# EAGLE schematic page1 (EAGLE 6.3)
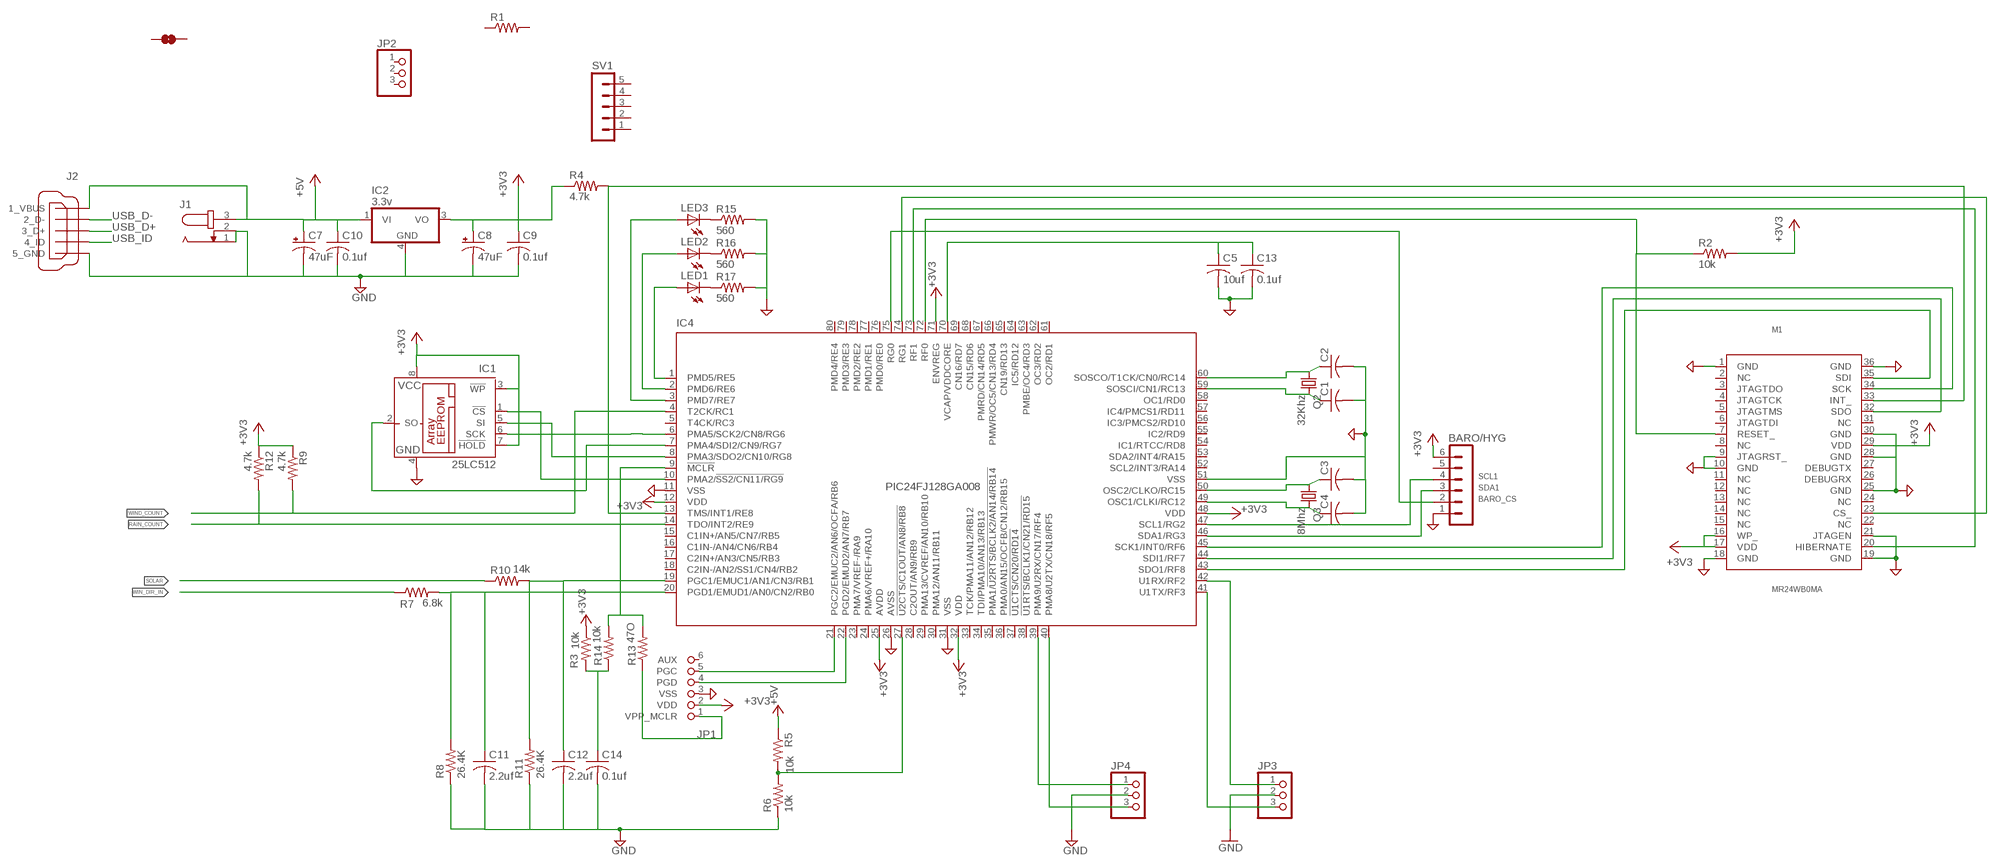
[diagram p0: schematic, sheet 1]

## Parts
BARO/HYG  MA06-1  [MA06-1]
C1  C-USC0603  [C0603]
C2  C-USC0603  [C0603]
C3  C-USC0603  [C0603]
C4  C-USC0603  [C0603]
C5  10uf  C-USC0805  [C0805]
C7  47uF  CPOL-US140CLH-0810  [140CLH-0810]
C8  47uF  CPOL-US140CLH-0810  [140CLH-0810]
C9  0.1uf  C-USC0805  [C0805]
C10  0.1uf  C-USC0805  [C0805]
C11  2.2uf  C-USC1206  [C1206]
C12  2.2uf  C-USC1206  [C1206]
C13  0.1uf  C-USC0805  [C0805]
C14  0.1uf  C-USC0805  [C0805]
IC1  25LC512  25LC080SN  [SO-08]
IC2  3.3v  78MXXL  [DPACK]
IC4  PIC24FJ128GA008  [TQFP80-12X12]
J1  JACK-PLUG0  [SPC4077]
J2  MINI-USB-32005-201  [32005-201]
JP1  PIKIT2_PRG  [1X06]
JP2  PINHD-1X3  [1X03]
JP3  PINHD-1X3  [1X03]
JP4  PINHD-1X3  [1X03]
LED1  LEDCHIP-LED0603  [CHIP-LED0603]
LED2  LEDCHIP-LED0603  [CHIP-LED0603]
LED3  LEDCHIP-LED0603  [CHIP-LED0603]
M1  MR24WB0MA  [MRF24W]
Q2  32Khz  CRYSTALTC26H  [TC26H]
Q3  8Mhz  CRYSTALHC49S  [HC49/S]
R1  R-US_R0603  [R0603]
R2  10k  R-US_R0603  [R0603]
R3  10k  R-US_R0603  [R0603]
R4  4.7k  R-US_R0603  [R0603]
R5  10k  R-US_R0603  [R0603]
R6  10k  R-US_R0603  [R0603]
R7  6.8k  R-US_R0603  [R0603]
R8  26.4K  R-US_R0603  [R0603]
R9  4.7k  R-US_R0603  [R0603]
R10  14k  R-US_R0603  [R0603]
R11  26.4K  R-US_R0603  [R0603]
R12  4.7k  R-US_R0603  [R0603]
R13  47O  R-US_R0603  [R0603]
R14  10k  R-US_R0603  [R0603]
R15  560  R-US_R0603  [R0603]
R16  560  R-US_R0603  [R0603]
R17  560  R-US_R0603  [R0603]
SV1  MA05-1  [MA05-1]
U$2  SOLDERBRIDGE  [SOLDER_BRIDGE]

## Nets
+3V3: BARO/HYG.6 C8.+ C9.1 IC1.3(!WP) IC1.7(!HOLD) IC1.8(VCC) IC2.3(VO) IC4.12(VDD) IC4.25(AVDD) IC4.32(VDD) IC4.48(VDD) IC4.71(ENVREG) JP1.2(VDD) M1.16(WP_) M1.17(VDD) M1.29(VDD) R2.2 R3.1 R4.1 R9.1 R12.1
+5V: C7.+ C10.1 IC2.1(VI) J1.3 J2.1_VBUS R5.1
BARO_CS: BARO/HYG.2 IC4.75(RG0)
GND: BARO/HYG.1 C1.2 C2.2 C3.2 C4.2 C5.2 C7.- C8.- C9.2 C10.2 C11.2 C12.2 C13.2 C14.2 IC1.4(GND) IC2.4(GND) IC4.11(VSS) IC4.26(AVSS) IC4.31(VSS) IC4.51(VSS) J1.1 J1.2 J2.5_USB_GND(5_GND) JP1.3(VSS) JP3.2 JP4.2 M1.1(GND) M1.9(JTAGRST_) M1.10(GND) M1.18(GND) M1.19(GND) M1.21(JTAGEN) M1.25(GND) M1.28(GND) M1.30(GND) M1.36(GND) R6.1 R8.1 R11.1 R15.2 R16.2 R17.2
N$1: C2.1 IC4.60(SOSCO/T1CK/CN0/RC14) Q2.1
N$2: C1.1 IC4.59(SOSCI/CN1/RC13) Q2.2
N$3: IC4.42(U1RX/RF2) JP3.1
N$4: C3.1 IC4.50(OSC2/CLKO/RC15) Q3.1
N$5: C4.1 IC4.49(OSC1/CLKI/RC12) Q3.2
N$6: IC4.41(U1TX/RF3) JP3.3
N$7: IC4.40(PMA8/U2TX/CN18/RF5) JP4.3
N$8: IC4.39(PMA9/U2RX/CN17/RF4) JP4.1
N$9: IC4.73(RF1) M1.20(HIBERNATE)
N$10: IC4.72(RF0) M1.7(RESET_) R2.1
N$11: IC4.45(SCK1/INT0/RF6) M1.34(SCK)
N$12: IC4.44(SDI1/RF7) M1.32(SDO)
N$13: IC4.43(SDO1/RF8) M1.35(SDI)
N$14: IC4.27(!U2CTS/C1OUT/AN8/RB8) R5.2 R6.2
N$15: IC4.74(RG1) M1.23(CS_)
N$16: IC4.21(PGC2/EMUC2/AN6/OCFA/RB6) JP1.5(PGC)
N$17: IC4.22(PGD2/EMUD2/AN7/RB7) JP1.4(PGD)
N$18: C12.1 IC4.19(PGC1/EMUC1/AN1/CN3/RB1) R10.2 R11.2
N$19: C5.1 C13.1 IC4.70(VCAP/VDDCORE)
N$20: IC4.9(!MCLR) R13.2 R14.2
N$21: C11.1 IC4.20(PGD1/EMUD1/AN0/CN2/RB0) R7.2 R8.2
N$22: C14.1 R3.2 R14.1
N$23: LED1.C R17.1
N$24: JP1.1(VPP_MCLR) R13.1
N$25: IC1.2(SO) IC4.7(PMA4/SDI2/CN9/RG7)
N$26: IC4.13(TMS/INT1/RE8) M1.33(INT_) R4.2
N$27: IC1.1(!CS) IC4.10(PMA2/!SS2/CN11/RG9)
N$28: LED2.C R16.1
N$29: IC1.6(SCK) IC4.6(PMA5/SCK2/CN8/RG6)
N$30: LED3.C R15.1
N$31: IC4.1(PMD5/RE5) LED1.A
N$32: IC1.5(SI) IC4.8(PMA3/SDO2/CN10/RG8)
N$33: IC4.2(PMD6/RE6) LED2.A
N$34: IC4.3(PMD7/RE7) LED3.A
RAIN_COUNT: IC4.14(TDO/INT2/RE9) R12.2
SCL1: BARO/HYG.4 IC4.47(SCL1/RG2)
SDA1: BARO/HYG.3 IC4.46(SDA1/RG3)
SOLAR: R10.1
USB_D+: J2.3_D+
USB_D-: J2.2_D-
USB_ID: J2.4_ID
WIN_DIR_IN: R7.1
WIND_COUNT: IC4.4(T2CK/RC1) R9.2
Unconnected: BARO/HYG.5 IC4.5(T4CK/RC3) IC4.15(C1IN+/AN5/CN7/RB5) IC4.16(C1IN-/AN4/CN6/RB4) IC4.17(C2IN+/AN3/CN5/RB3) IC4.18(C2IN-/AN2/SS1/CN4/RB2) IC4.23(PMA7/VREF-/RA9) IC4.24(PMA6/VREF+/RA10) IC4.28(C2OUT/AN9/RB9) IC4.29(PMA13/CVREF/AN10/RB10) IC4.30(PMA12/AN11/RB11) IC4.33(TCK/PMA11/AN12/RB12) IC4.34(TDI/PMA10/AN13/RB13) IC4.35(PMA1/!U2RTS/BCLK2/AN14/RB14) IC4.36(PMA0/AN15/OCFB/CN12/RB15) IC4.37(!U1CTS/CN20/RD14) IC4.38(!U1RTS/BCLK1/CN21/RD15) IC4.52(SCL2/INT3/RA14) IC4.53(SDA2/INT4/RA15) IC4.54(IC1/RTCC/RD8) IC4.55(IC2/RD9) IC4.56(IC3/PMCS2/RD10) IC4.57(IC4/PMCS1/RD11) IC4.58(OC1/RD0) IC4.61(OC2/RD1) IC4.62(OC3/RD2) IC4.63(PMBE/OC4/RD3) IC4.64(IC5/RD12) IC4.65(CN19/RD13) IC4.66(PMWR/OC5/CN13/RD4) IC4.67(PMRD/CN14/RD5) IC4.68(CN15/RD6) IC4.69(CN16/RD7) IC4.76(PMD0/RE0) IC4.77(PMD1/RE1) IC4.78(PMD2/RE2) IC4.79(PMD3/RE3) IC4.80(PMD4/RE4) JP1.6(AUX) JP2.1 JP2.2 JP2.3 M1.2(NC) M1.3(JTAGTDO) M1.4(JTAGTCK) M1.5(JTAGTMS) M1.6(JTAGTDI) M1.8(NC) M1.11(NC) M1.12(NC) M1.13(NC) M1.14(NC) M1.15(NC) M1.22(NC) M1.24(NC) M1.26(DEBUGRX) M1.27(DEBUGTX) M1.31(NC) R1.1 R1.2 SV1.1 SV1.2 SV1.3 SV1.4 SV1.5 U$2.P$1 U$2.P$2

## Library data of the parts
BARO/HYG = con-lstb:MA06-1: PIN HEADER; OC_FARNELL: unknown; OC_NEWARK: unknown
C1-C5 C9-C14 = rcl:C-US: CAPACITOR, American symbol
C7 C8 = rcl:CPOL-US: POLARIZED CAPACITOR, American symbol
IC1 = microchip:25*: Serial EEPROM 4K/ 8K , SPI bus; MF: MICROCHIP; MPN: 25LC080/SN; OC_FARNELL: 1137302; OC_NEWARK: 96K4092
IC2 = Stofer:78MXXL: VOLTAGE REGULATOR
IC4 = microchip:PIC24FJ*GA008: 64/80/100-Pin General Purpose, 16-Bit Flash Microcontrollers Source: http://ww1.microchip.com/downloads/en/DeviceDoc/39747d.pdf; MF: MICROCHIP; MPN: PIC24FJ128GA008-I/PT; OC_FARNELL: 1146521; OC_NEWARK: 56K7339
J1 = con-jack:JACK-PLUG: DC POWER JACK Power Jack, DC, Right Angle, Through Hole, Rated 5A at 16VDC, PC Terminals Distributor: Farnell (www.Farnell.de) Drawing: 84N1161.pdf / 84N1162.pdf Manufacturer: SPC Technology (www.spctechnology.com) Type: SPC4077 / SPC 4078; OC_FARNELL: unknown; OC_NEWARK: unknown
J2 = 1AA_Stofer:MINI-USB-: MINI USB-B Conector Source: www.cypressindustries.com
JP1 = Stofer:PIKIT2_PRG: PIN HEADER
JP2-JP4 = Stofer:PINHD-1X3: PIN HEADER
LED1-LED3 = led:LED: LED OSRAM: - CHIPLED LG R971, LG N971, LY N971, LG Q971, LY Q971, LO R971, LY R971 LH N974, LH R974 LS Q976, LO Q976, LY Q976 LO Q996 - Hyper CHIPLED LW Q18S LB Q993, LB Q99A, LB R99A - SideLED LS A670, LO A670, LY A670, LG A670, LP A670 LB A673, LV A673, LT A673, LW A673 LH A674 LY A675 LS A676, LA A676, LO A676, LY A676, LW A676 LS A679, LY A679, LG A679 - Hyper Micro SIDELED® LS Y876, LA Y876, LO Y876, LY Y876 LT Y87S - SmartLED LW L88C, LW L88S LB L89C, LB L89S, LG L890 LS L89K, LO L89K, LY L89K LS L896, LA L896, LO L896, LY L896 - TOPLED LS T670, LO T670, LY T670, LG T670, LP T670 LSG T670, LSP T670, LSY T670, LOP T670, LYG T670 LG T671, LOG T671, LSG T671 LB T673, LV T673, LT T673, LW T673 LH T674 LS T676, LA T676, LO T676, LY T676, LB T676, LH T676, LSB T676, LW T676 LB T67C, LV T67C, LT T67C, LS T67K, LO T67K, LY T67K, LW E67C LS E67B, LA E67B, LO E67B, LY E67B, LB E67C, LV E67C, LT E67C LW T67C LS T679, LY T679, LG T679 LS T770, LO T770, LY T770, LG T770, LP T770 LB T773, LV T773, LT T773, LW T773 LH T774 LS E675, LA E675, LY E675, LS T675 LS T776, LA T776, LO T776, LY T776, LB T776 LHGB T686 LT T68C, LB T68C - Hyper Mini TOPLED® LB M676 - Mini TOPLED Santana® LG M470 LS M47K, LO M47K, LY M47K Source: http://www.osram.convergy.de LUXEON: - LUMILED® LXK2-PW12-R00, LXK2-PW12-S00, LXK2-PW14-U00, LXK2-PW14-V00 LXK2-PM12-R00, LXK2-PM12-S00, LXK2-PM14-U00 LXK2-PE12-Q00, LXK2-PE12-R00, LXK2-PE12-S00, LXK2-PE14-T00, LXK2-PE14-U00 LXK2-PB12-K00, LXK2-PB12-L00, LXK2-PB12-M00, LXK2-PB14-N00, LXK2-PB14-P00, LXK2-PB14-Q00 LXK2-PR12-L00, LXK2-PR12-M00, LXK2-PR14-Q00, LXK2-PR14-R00 LXK2-PD12-Q00, LXK2-PD12-R00, LXK2-PD12-S00 LXK2-PH12-R00, LXK2-PH12-S00 LXK2-PL12-P00, LXK2-PL12-Q00, LXK2-PL12-R00 Source: www.luxeon.com KINGBRIGHT: KA-3528ASYC Source: www.kingbright.com
M1 = 1AA_Stofer:MR24WB0MA: Mirochip/ZeroG Wifi module
Q2 = crystal:CRYSTAL: CRYSTAL; OC_FARNELL: unknown; OC_NEWARK: unknown
Q3 = crystal:CRYSTAL: CRYSTAL; OC_FARNELL: 1667008; OC_NEWARK: unknown
R1-R17 = rcl:R-US_: RESISTOR, American symbol
SV1 = con-lstb:MA05-1: PIN HEADER; OC_FARNELL: unknown; OC_NEWARK: unknown
U$2 = Stofer:SOLDERBRIDGE